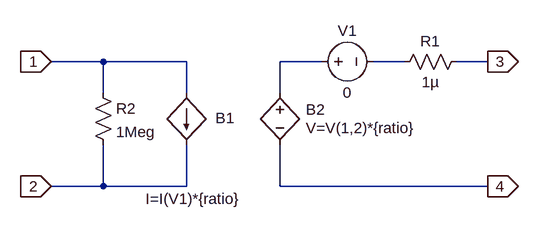
[diagram p0: schematic XFMR.asc]
XFMR.asc, the LTspice schematic file:
Version 4.1
SHEET 1 880 680
WIRE 32 96 -48 96
WIRE 160 96 32 96
WIRE 368 96 304 96
WIRE 496 96 448 96
WIRE 624 96 576 96
WIRE 32 144 32 96
WIRE 160 144 160 96
WIRE 304 144 304 96
WIRE 32 288 32 224
WIRE 32 288 -48 288
WIRE 160 288 160 224
WIRE 160 288 32 288
WIRE 304 288 304 224
WIRE 624 288 304 288
FLAG 624 288 4
IOPIN 624 288 Out
FLAG 624 96 3
IOPIN 624 96 Out
FLAG -48 96 1
IOPIN -48 96 In
FLAG -48 288 2
IOPIN -48 288 In
SYMBOL bi 160 144 R0
WINDOW 0 45 39 Left 2
WINDOW 3 -63 163 Left 2
SYMATTR InstName B1
SYMATTR Value I=I(V1)*{ratio}
SYMBOL bv 304 128 R0
WINDOW 0 40 42 Left 2
WINDOW 3 40 70 Left 2
SYMATTR InstName B2
SYMATTR Value V=V(1,2)*{ratio}
SYMBOL voltage 352 96 R270
WINDOW 0 32 56 VTop 2
WINDOW 3 -32 56 VBottom 2
WINDOW 123 0 0 Left 0
WINDOW 39 0 0 Left 0
SYMATTR InstName V1
SYMATTR Value 0
SYMBOL res 592 80 R90
WINDOW 0 0 56 VBottom 2
WINDOW 3 32 56 VTop 2
SYMATTR InstName R1
SYMATTR Value 1µ
SYMBOL res 16 128 R0
SYMATTR InstName R2
SYMATTR Value 1Meg

The netlist it stands for:
* XFMR.asc
B1 1 2 I=I(V1)*{ratio}
B2 N001 4 V=V(1,2)*{ratio}
V1 N001 N002 0
R1 3 N002 1µ
R2 1 2 1Meg
.backanno
.end